# Altium project TL3572-EVM-A1.1-000-SCH-202609041404.PrjPcb (part 6 of 6)
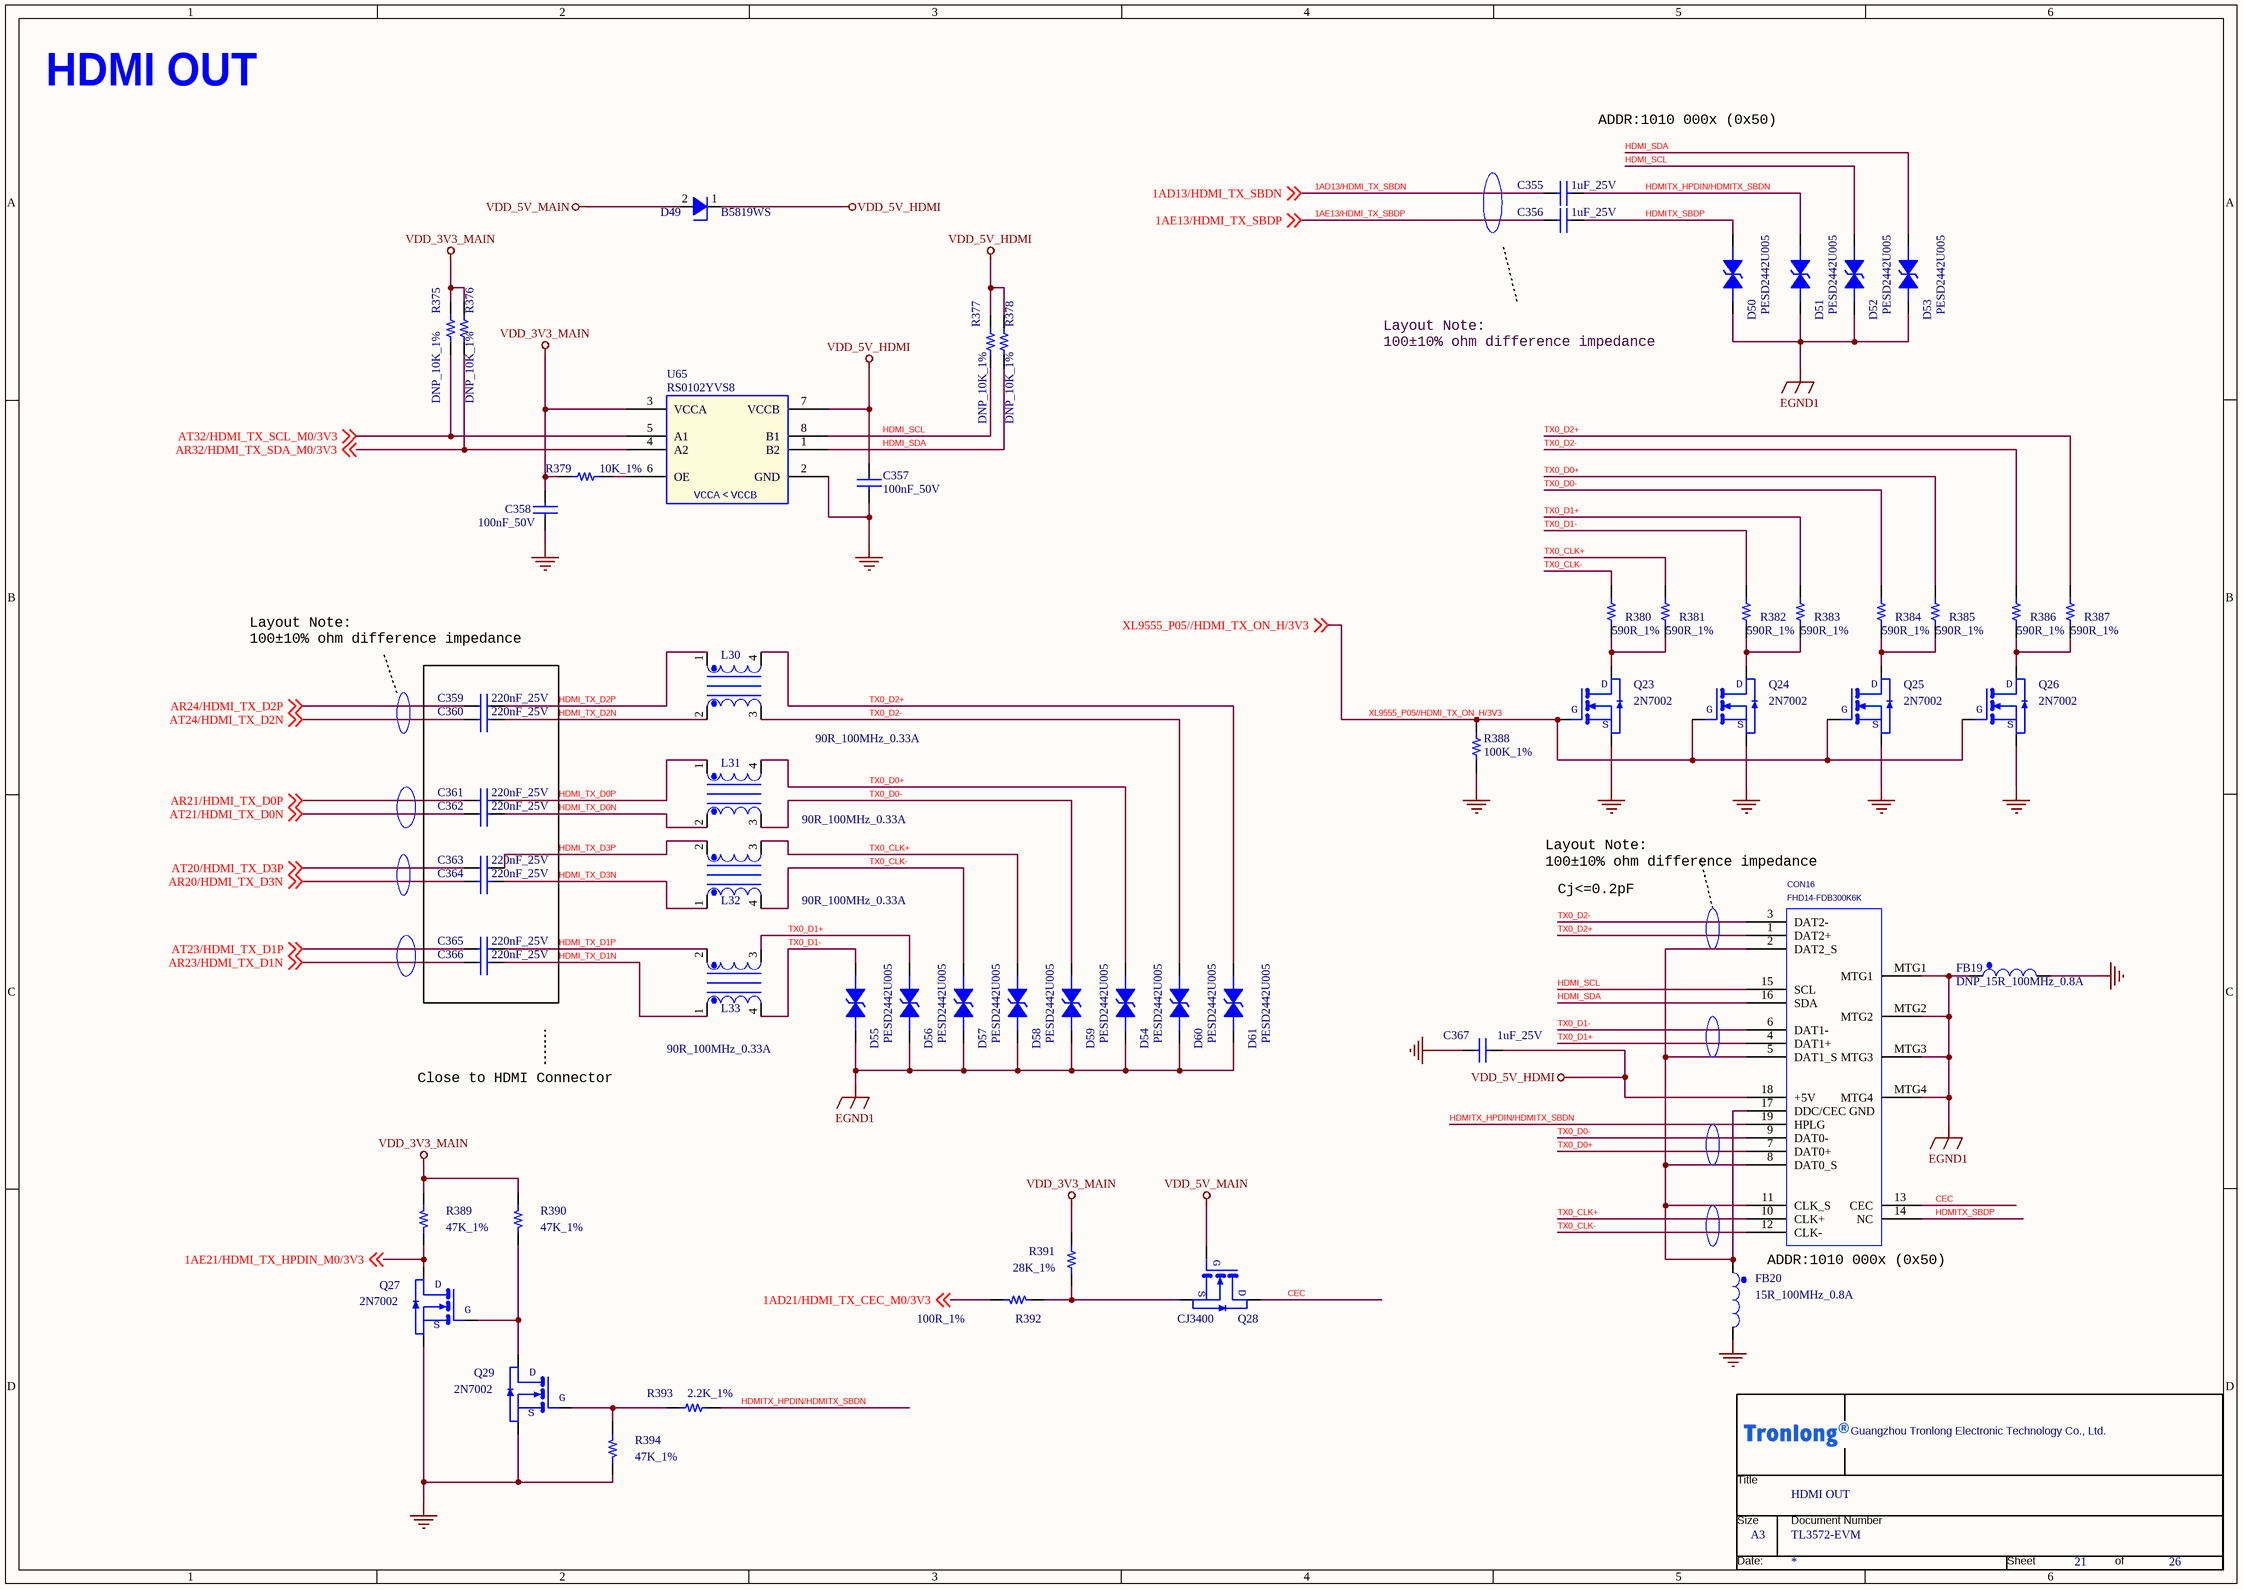
[diagram p12: P21_HDMI OUT.SchDoc]

## Nets that join several sheets
EGND1: P04_POWER01 (R12.2 R13.2), P05_POWER02 (6 pins), P13_ETH1 RGMII (11 pins), P21_HDMI OUT (17 pins)
GND: P03_SOM CONNECTOR CON0 (89 pins), P04_POWER01 (34 pins), P05_POWER02 (40 pins), P08_KEY_BOOT SET (23 pins), P13_ETH1 RGMII (34 pins), P19_M.2 KEY M SSD_WI-FI_BT (55 pins), P21_HDMI OUT (14 pins)
VDD_1V8_MAIN: P03_SOM CONNECTOR CON0 (12 pins), P05_POWER02 (7 pins), P08_KEY_BOOT SET (C83.1 R107.1 R111.2 R113.2)
VDD_3V3_MAIN: P03_SOM CONNECTOR CON0 (8 pins), P04_POWER01 (R21.2), P05_POWER02 (8 pins), P08_KEY_BOOT SET (R108.1 R109.1), P13_ETH1 RGMII (FB11.1), P19_M.2 KEY M SSD_WI-FI_BT (R341.1 R342.1), P21_HDMI OUT (8 pins)
VDD_3V3_SOM_OUTPUT: P03_SOM CONNECTOR CON0 (C12.1 C13.1 CON0.D17), P05_POWER02 (5 pins), P19_M.2 KEY M SSD_WI-FI_BT (R333.2)
VDD_5V_MAIN: P05_POWER02 (7 pins), P21_HDMI OUT (D49.2 Q28.1)
VDD_5V_SOM: P03_SOM CONNECTOR CON0 (6 pins), P05_POWER02 (D10.1 F2.2 TP8.1)
VDD_12V_MAIN: P04_POWER01 (5 pins), P05_POWER02 (17 pins), P19_M.2 KEY M SSD_WI-FI_BT (C296.1 C298.1 C303.1 U61.5)
1A6/ETH0_TXD0/3V3: P03_SOM CONNECTOR CON0 (R493.2), P13_ETH1 RGMII (U41.18)
1AD13/HDMI_TX_SBDN: P03_SOM CONNECTOR CON0 (CON0.A65), P21_HDMI OUT (C355.1)
1AD19/SARADC_IN1/RECOVERY/USER_KEY1/PU/1V8: P03_SOM CONNECTOR CON0 (CON0.A17), P08_KEY_BOOT SET (R112.1)
1AD21/HDMI_TX_CEC_M0/3V3: P03_SOM CONNECTOR CON0 (CON0.A21), P21_HDMI OUT (R392.2)
1AE13/HDMI_TX_SBDP: P03_SOM CONNECTOR CON0 (CON0.A67), P21_HDMI OUT (C356.1)
1AE21/HDMI_TX_HPDIN_M0/3V3: P03_SOM CONNECTOR CON0 (CON0.A23), P21_HDMI OUT (Q27.3 R389.2)
1AF21/SARADC_IN0_BOOT/MASKROM/PU/1V8: P03_SOM CONNECTOR CON0 (CON0.A5), P08_KEY_BOOT SET (R105.1 R106.1)
1B4/ETH0_RXD2/3V3: P03_SOM CONNECTOR CON0 (CON0.C27), P13_ETH1 RGMII (R205.1)
1B6/ETH0_TXD1/3V3: P03_SOM CONNECTOR CON0 (R497.1), P13_ETH1 RGMII (U41.17)
1C4/ETH0_RXD3/3V3: P03_SOM CONNECTOR CON0 (CON0.C18), P13_ETH1 RGMII (R206.1)
1C6/ETH0_TXCTL/3V3: P03_SOM CONNECTOR CON0 (R494.2), P13_ETH1 RGMII (U41.19)
1D6/ETH0_RXD0/3V3: P03_SOM CONNECTOR CON0 (CON0.C26), P13_ETH1 RGMII (R203.1)
1H21/PCIE1_REFCLKP: P03_SOM CONNECTOR CON0 (CON0.D20), P19_M.2 KEY M SSD_WI-FI_BT (CON13.55)
1H22/PCIE1_REFCLKN: P03_SOM CONNECTOR CON0 (CON0.D18), P19_M.2 KEY M SSD_WI-FI_BT (CON13.53)
1K20/GPIO0_A0_d/USER_KEY2/1V8: P03_SOM CONNECTOR CON0 (CON0.D10), P08_KEY_BOOT SET (R114.1)
A5/ETH0_TXD2/3V3: P03_SOM CONNECTOR CON0 (R499.1), P13_ETH1 RGMII (U41.16)
A7/ETH0_RXD1/3V3: P03_SOM CONNECTOR CON0 (CON0.C3), P13_ETH1 RGMII (R204.1)
A10/ETH0_RXCTL/3V3: P03_SOM CONNECTOR CON0 (CON0.C23), P13_ETH1 RGMII (R202.1)
AR20/HDMI_TX_D3N: P03_SOM CONNECTOR CON0 (CON0.A41), P21_HDMI OUT (C364.1)
AR21/HDMI_TX_D0P: P03_SOM CONNECTOR CON0 (CON0.A49), P21_HDMI OUT (C361.1)
AR23/HDMI_TX_D1N: P03_SOM CONNECTOR CON0 (CON0.A53), P21_HDMI OUT (C366.1)
AR24/HDMI_TX_D2P: P03_SOM CONNECTOR CON0 (CON0.A61), P21_HDMI OUT (C359.1)
AR32/HDMI_TX_SDA_M0/3V3: P03_SOM CONNECTOR CON0 (CON0.A35), P21_HDMI OUT (R376.2 U65.4)
AT20/HDMI_TX_D3P: P03_SOM CONNECTOR CON0 (CON0.A43), P21_HDMI OUT (C363.1)
AT21/HDMI_TX_D0N: P03_SOM CONNECTOR CON0 (CON0.A47), P21_HDMI OUT (C362.1)
AT23/HDMI_TX_D1P: P03_SOM CONNECTOR CON0 (CON0.A55), P21_HDMI OUT (C365.1)
AT24/HDMI_TX_D2N: P03_SOM CONNECTOR CON0 (CON0.A59), P21_HDMI OUT (C360.1)
AT32/HDMI_TX_SCL_M0/3V3: P03_SOM CONNECTOR CON0 (CON0.A37), P21_HDMI OUT (R375.2 U65.5)
B5/ETH0_TXD3/3V3: P03_SOM CONNECTOR CON0 (R498.1), P13_ETH1 RGMII (U41.15)
B7/ETH0_RXCLK/3V3: P03_SOM CONNECTOR CON0 (CON0.C9), P13_ETH1 RGMII (R201.1)
B8/ETH0_TXCLK/3V3: P03_SOM CONNECTOR CON0 (C437.1 CON0.C25), P13_ETH1 RGMII (U41.20)
B9/ETH0_MDC/3V3: P03_SOM CONNECTOR CON0 (R506.2), P13_ETH1 RGMII (U41.13)
B10/ETH0_MDIO/3V3: P03_SOM CONNECTOR CON0 (CON0.C12), P13_ETH1 RGMII (R208.2 U41.14)
K32/PCIE1_RXN: P03_SOM CONNECTOR CON0 (CON0.D30), P19_M.2 KEY M SSD_WI-FI_BT (CON13.41)
K33/PCIE1_RXP: P03_SOM CONNECTOR CON0 (CON0.D32), P19_M.2 KEY M SSD_WI-FI_BT (CON13.43)
L32/PCIE1_TXN: P03_SOM CONNECTOR CON0 (CON0.D24), P19_M.2 KEY M SSD_WI-FI_BT (C305.2)
L33/PCIE1_TXP: P03_SOM CONNECTOR CON0 (CON0.D26), P19_M.2 KEY M SSD_WI-FI_BT (C304.2)
P32/NPOR_u/PU/1V8: P03_SOM CONNECTOR CON0 (CON0.D2), P08_KEY_BOOT SET (Q13.2 R104.1)
P32/NPOR_u/PU/3V3: P05_POWER02 (R55.2), P08_KEY_BOOT SET (C84.1 Q13.3 R108.2)
RK806S_PWRON/PU/5V: P03_SOM CONNECTOR CON0 (CON0.D15), P08_KEY_BOOT SET (R110.1)